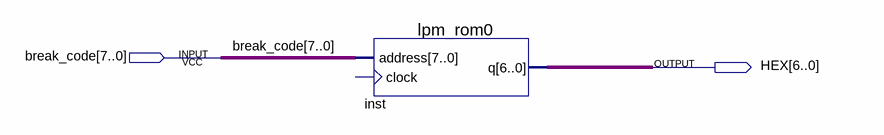
[diagram p0: schematic sheet]
// Quartus schematic display.bdf as structural Verilog: 1 symbols, 2 pins
module display (
  input  [7:0] break_code,
  output [6:0] HEX
);

  lpm_rom0 inst (.address(break_code), .q(HEX));  // open: clock
endmodule
